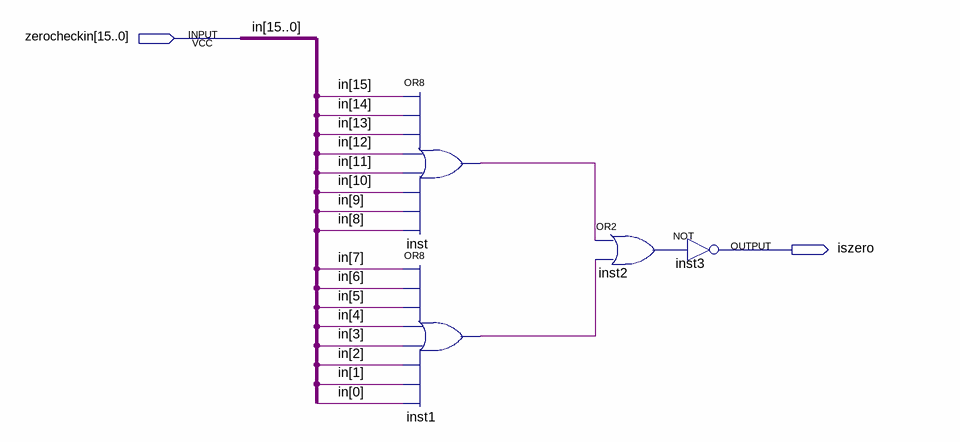
[diagram p0: schematic sheet]
// Quartus schematic iszero.bdf as structural Verilog: 4 symbols, 2 pins
module iszero (
  input  [15:0] zerocheckin,
  output iszero
);

  wire inst1_out, inst2_out, inst_out;

  or inst (inst_out, zerocheckin[15], zerocheckin[14], zerocheckin[13], zerocheckin[12], zerocheckin[11], zerocheckin[10], zerocheckin[9], zerocheckin[8]);
  or inst1 (inst1_out, zerocheckin[7], zerocheckin[6], zerocheckin[5], zerocheckin[4], zerocheckin[3], zerocheckin[2], zerocheckin[1], zerocheckin[0]);
  or inst2 (inst2_out, inst_out, inst1_out);
  not inst3 (iszero, inst2_out);

  // Other names for the same wires on the sheet: in[15:0] = zerocheckin
endmodule
